# EAGLE design harp to ONIX converter (EAGLE 9.5.1)
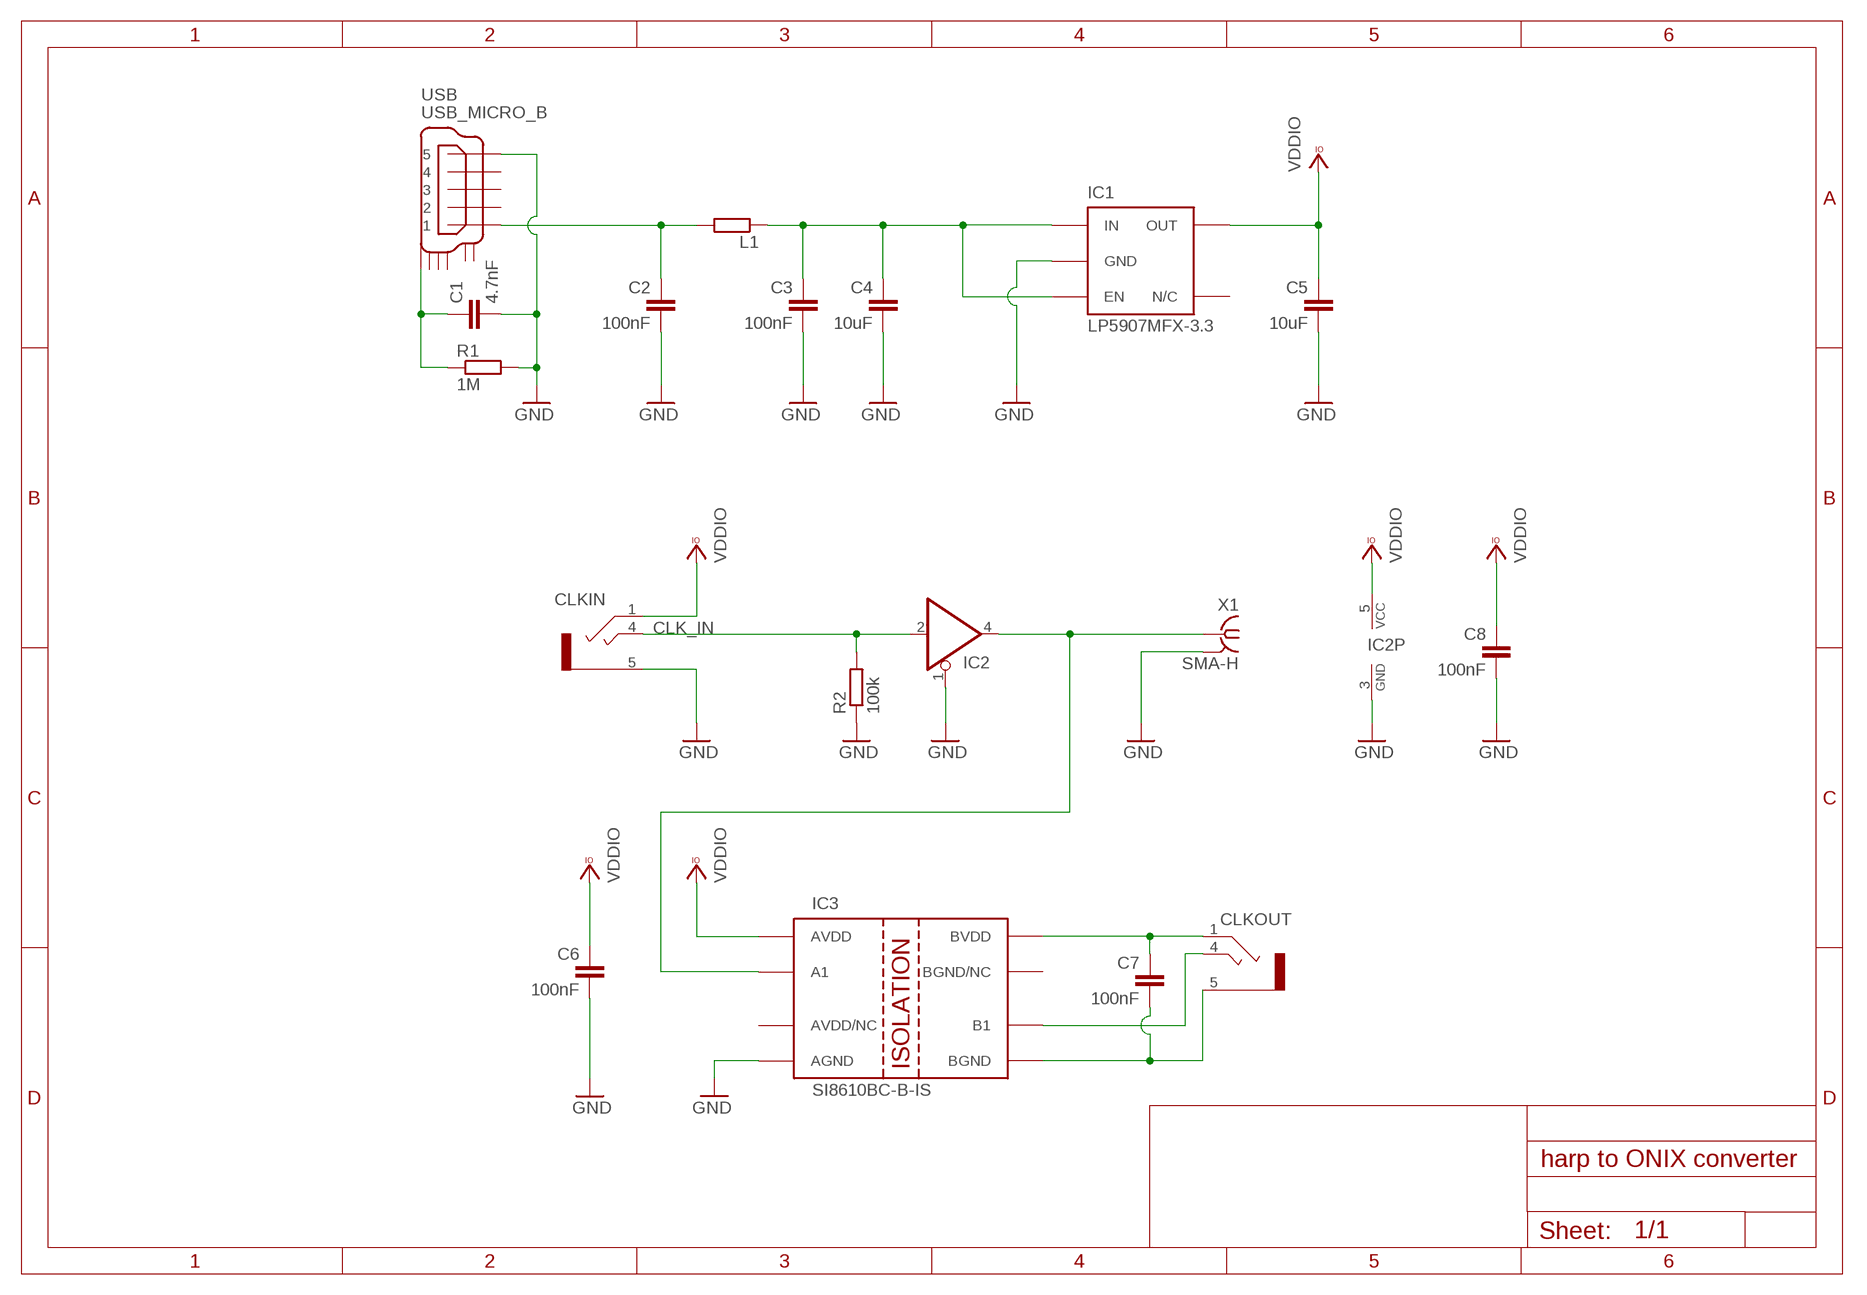
[diagram p0: schematic, sheet 1]

## Parts
C1  4.7nF  C-EUC0402  [C0402]
C2  100nF  C-EUC0402  [C0402]
C3  100nF  C-EUC0402  [C0402]
C4  10uF  C-EUC0603  [C0603]
C5  10uF  C-EUC0603  [C0603]
C6  100nF  C-EUC0402  [C0402]
C7  100nF  C-EUC0402  [C0402]
C8  100nF  C-EUC0402  [C0402]
CLKIN  STEREO_JACK  [35RASMT2BHNTRX]
CLKOUT  CLCK_JACK  STEREO_JACK  [35RASMT2BHNTRX]
IC1  LP5907MFX-3.3  TLV700XX  [TSOT23-5]
IC2  74AHC1G125DBV  [SOT23-5]
IC3  SI8610BC-B-IS  SI8610  [SO-08]
L1  ???  R-EU_R0805  [R0805]
R1  1M  R-EU_R0402  [R0402]
R2  100k  R-EU_R0402  [R0402]
USB  USB_MICRO_B  [ZX62D-B-5P8]
X1  SMA-H  BU-SMA-V  [BU-SMA-V]

## Nets
5V_RAW: C3.1 C4.1 IC1.1(IN) IC1.3(EN) L1.1
CLK_IN: CLKIN.4 IC2.2(I) R2.2
GND: C1.2 C2.2 C3.2 C4.2 C5.2 C6.2 C8.2 CLKIN.5 IC1.2(GND) IC2.1(OE) IC2.3(GND) IC3.4(AGND) R1.2 R2.1 USB.P$5 X1.2 X1.3 X1.4 X1.5
GND_ISO: C7.2 CLKOUT.5 IC3.5(BGND)
N$1: IC2.4(O) IC3.2(A1) X1.1
N$2: CLKOUT.4 IC3.6(B1)
N$5: C7.1 CLKOUT.1 IC3.8(BVDD)
N$39: C2.1 L1.2 USB.P$1
N$59: C1.1 R1.1 USB.SHIELD_4
VCCIO: C5.1 C6.1 C8.1 CLKIN.1 IC1.5(OUT) IC2.5(VCC) IC3.1(AVDD) ; supply symbol labelled VDDIO
Unconnected: IC1.4(N/C) IC3.3(AVDD/NC) IC3.7(BGND/NC) USB.P$2 USB.P$3 USB.P$4 USB.P$6 USB.P$7 USB.SHIELD_1 USB.SHIELD_2 USB.SHIELD_3

## Library data of the parts
C1-C6 C8 = rcl:C-EU: CAPACITOR, European symbol
C7 = rcl:C-EU: CAPACITOR, European symbol; MPN: MC0402B104K160CT; NOTES: -; TYPE: SMD
CLKIN = CNP-connectors:STEREO_JACK
CLKOUT = harp input expander:STEREO_JACK: CONN JACK STEREO 3.5MM SMD R/A; MPN: 35RASMT2BHNTRX; NOTES: -; TYPE: SMD
IC1 = CNP:TLV700XX
IC2 = 74xx-little-de:74*1G125: Single Bus Buffer Gate with 3-State Output
IC3 = harp input expander:SI8610: DGTL ISO 3750VRMS 1CH GP 8SOIC; MPN: SI8610EC-B-IS; NOTES: -; TYPE: SMD
L1 R1 R2 = rcl:R-EU_: RESISTOR, European symbol
USB = CNP-connectors:USB_MICRO_B
X1 = con-coax:BU-SMA-V: FEMALE SMA CONNECTOR Radiall distributor RS 112-3794; OC_FARNELL: unknown; OC_NEWARK: unknown

## Board
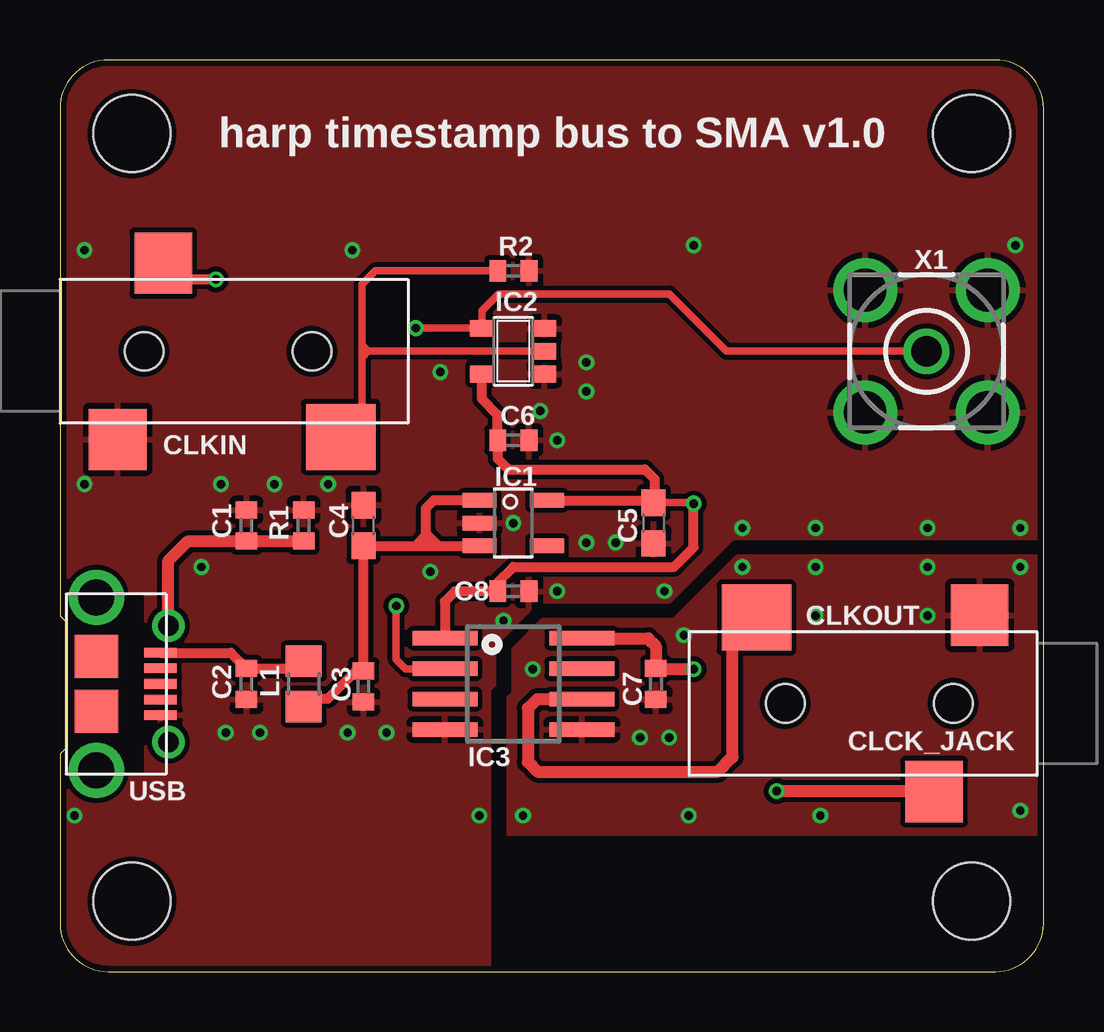
[diagram p1: board, top side]
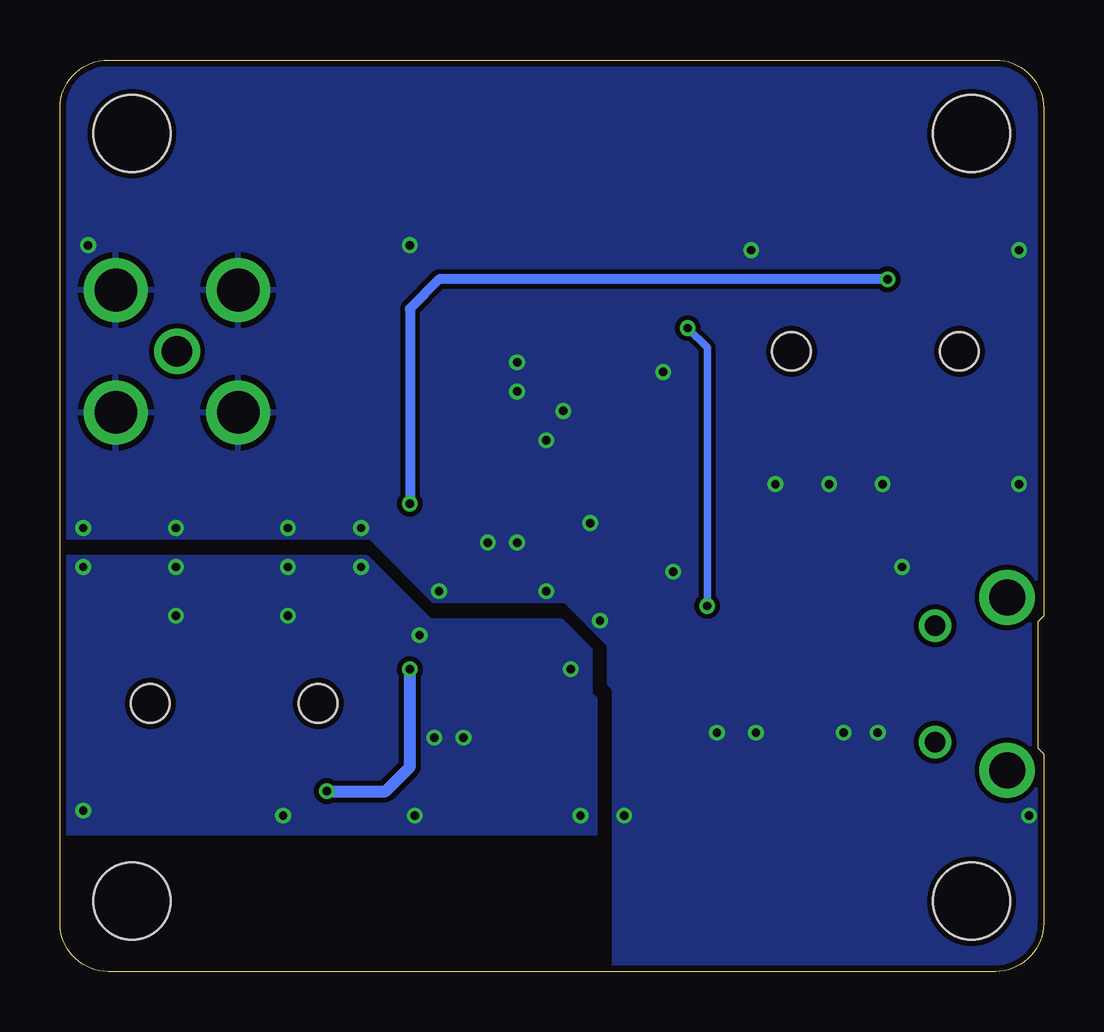
[diagram p2: board, bottom side, seen from below]

Size 41 x 38 mm. Coordinates in mm from the lower left corner, seen from the top.
Outline: 2,0 39,0 arc90 41,2 41,36 arc90 39,38 2,38 arc90 0,36 0,14.83 0.25,14.58 0.25,9.33 0,9.08 0,2 arc90 2,0
Copper layers (1*16): Top 0.035mm / dielectric 1.5mm / Bottom 0.035mm
Design rules "seeed-studio-2-layer": minimum track width 6mil, minimum drill 12mil, track to track 8mil, track to pad 8mil, pad to pad 8mil, via to via 8mil, smd to smd 0mil, copper to edge 10mil, drill to drill 10mil, minimum pad ring 10mil, minimum via ring 6mil, stop-mask expansion 2mil, vias tented up to drill 100mil, thermal gap 10mil
Holes 3.2 mm at 38,2.94 3,2.94 3,34.94 38,34.94

### Footprints (pad centres in the part's own frame; a part is rotated, then mirrored left to right if it is on the bottom)
C0402 = smd 0.7 x 0.9: 1 -0.65,0; 2 0.65,0
C0603 = smd 1.1 x 1: 1 -0.85,0; 2 0.85,0
35RASMT2BHNTRX = smd 2.4 x 2.55: 1 0.8,3.675; 5 -1.1,-3.675 | smd 2.9 x 2.75: 4 8.2,-3.575 | hole 1.6: 0,0; 7,0
TSOT23-5 = smd 0.6 x 1.408: 1 -0.95,-1.404; 2 0,-1.404; 3 0.95,-1.404; 4 0.95,1.404; 5 -0.95,1.404
SOT23-5 = smd 0.69 x 0.99: 1 -0.95,-1.29; 2 0,-1.29; 3 0.95,-1.29; 4 0.95,1.3; 5 -0.95,1.3
SO-08 = smd 0.6 x 2.708: 1 -1.905,-2.854; 2 -0.635,-2.854; 3 0.635,-2.854; 4 1.905,-2.854; 5 1.905,2.854; 6 0.635,2.854; 7 -0.635,2.854; 8 -1.905,2.854
R0805 = smd 1.3 x 1.5: 1 -0.95,0; 2 0.95,0
R0402 = smd 0.7 x 0.9: 1 -0.65,0; 2 0.65,0
ZX62D-B-5P8 = smd 0.4 x 1.35: P$1 -1.3,2.675; P$2 -0.65,2.675; P$3 0,2.675; P$4 0.65,2.675; P$5 1.3,2.675 | smd 1.8 x 1.8: P$6 -1.15,0; P$7 1.15,0 | drill 1.5 pad 2.3: SHIELD_1 -3.6,0; SHIELD_2 3.6,0 | drill 0.85 pad 1.25: SHIELD_3 2.425,3; SHIELD_4 -2.425,3
BU-SMA-V = drill 1.27: 1 0,0 | drill 1.778: 2 -2.55,2.55; 3 2.55,2.55; 4 2.55,-2.55; 5 -2.55,-2.55

### Placement (x,y rotation side)
C1  7.77,18.59 90 top
C2  7.77,11.99 270 top
C3  12.65,11.89 270 top
C4  12.65,18.59 90 top
C5  24.74,18.69 270 top
C6  18.9,22.15 0 top
C7  24.84,11.99 270 top
C8  18.9,15.85 0 top
CLKIN  3.51,25.86 0 top
CLKOUT  37.24,11.18 180 top
IC1  18.9,18.69 270 top
IC2  18.9,25.86 90 top
IC3  18.9,11.99 270 top
L1  10.16,11.99 90 top
R1  10.16,18.59 90 top
R2  18.9,29.21 180 top
USB  1.52,11.99 270 top
X1  36.12,25.86 0 top

### Tracks (layer width: path | path; a pad name or v marks a point on that pad's centre or on a via)
5V_RAW
  Top 0.406: L1.1 10.5,11.38 11.18,11.38 12.33,12.54 C3.1 C4.1 14.83,17.74 | 14.83,17.74 IC1.3 | IC1.1 15.58,19.64 15.24,19.3 15.24,18.29 | 15.24,18.29 15.24,18.15 14.83,17.74 | 15.24,18.29 15.75,17.78
CLK_IN
  Top 0.305: IC2.2 12.85,25.86 | 12.85,25.86 12.6,25.6 | 12.6,25.6 12.6,23.18 CLKIN.4 | R2.2 13.16,29.21 12.6,28.65 12.6,26.11 | 12.6,26.11 12.6,25.6 | 12.85,25.86 12.6,26.11
GND  (via drill 0.35)
  other vias: 40.03,18.49 36.17,18.49 31.5,18.49 28.45,18.49 25.2,15.85 20.73,15.85 18.49,14.63 17.48,6.5 0.61,6.5 13.61,9.96 11.99,9.96 8.33,9.96 6.91,9.96 8.94,20.32 6.71,20.32 11.18,20.32 18.9,18.69 23.16,17.88 21.95,17.88 20.02,23.37 20.73,22.15 21.95,25.4 21.95,24.18 15.85,24.99 39.83,30.28 1.02,30.07 12.19,30.07 26.42,30.28 1.02,20.32 5.89,16.87 15.44,16.66
  pour Top: 17.88,-0.75 17.88,11.79 18.08,11.99 18.08,13.61 19.91,15.44 25.4,15.44 28.04,18.08 43.89,18.08 43.89,40.95 -0.61,40.95 -0.61,-0.75
  pour Bottom: 17.88,-0.75 17.88,11.79 18.08,11.99 18.08,13.61 19.91,15.44 25.4,15.44 28.04,18.08 43.89,18.08 43.89,40.95 -0.61,40.95 -0.61,-0.75
GND_ISO  (via drill 0.35)
  other vias: 36.17,14.83 31.5,14.83 40.03,6.71 25.4,9.75 24.18,9.75 19.71,12.6 26.01,14.02 28.45,16.87 31.5,16.87 36.17,16.87 40.03,16.87 31.7,6.5 26.21,6.5 19.3,6.5
  pour Top: 43.89,17.27 28.24,17.27 25.6,14.63 20.12,14.63 18.9,13.41 18.9,11.58 18.69,11.38 18.69,5.75 43.89,5.75
  pour Bottom: 43.89,17.27 28.24,17.27 25.6,14.63 20.12,14.63 18.9,13.41 18.9,11.58 18.69,11.38 18.69,5.75 43.89,5.75
N$1  (via drill 0.35)
  Top 0.305: X1.1 27.79,25.86 25.4,28.25 18.29,28.25 17.6,27.55 IC2.4 17.58,26.82 v14.83,26.82 | IC3.2 14.4,12.62 14.02,13.01 v14.02,15.24
  Bottom 0.305: v14.02,15.24 14.02,26.01 v14.83,26.82
N$2
  Top 0.508: IC3.6 19.89,11.35 19.51,10.97 19.51,8.74 19.91,8.33 27.43,8.33 28.04,8.94 28.04,13.76 CLKOUT.4
N$5  (via drill 0.35)
  Top 0.508: IC3.8 24.51,13.89 24.84,13.56 C7.1 24.88,12.6 v26.42,12.6 | CLKOUT.1 36.42,7.52 v29.87,7.52
  Bottom 0.508: v29.87,7.52 27.43,7.52 26.42,8.53 v26.42,12.6
N$39
  Top 0.406: USB.P$1 7.12,13.29 C2.1 9.86,12.64 L1.2
N$59
  Top 0.508: USB.SHIELD_4 4.52,17.12 5.34,17.94 C1.1 R1.1
VCCIO  (via drill 0.35)
  Top 0.305: C5.1 26.38,19.54 v26.42,19.51 | 24.79,19.8 24.64,19.64
  Top 0.406: IC1.5 24.64,19.64 C5.1 24.94,19.34 | v26.42,19.51 26.42,17.68 25.6,16.87 18.9,16.87 18.25,16.22 C8.1 16.46,15.85 16.04,15.43 IC3.1 | 24.79,19.8 24.79,20.52 24.38,20.93 18.69,20.93 18.25,21.38 C6.1 18.25,23.2 17.6,23.86 IC2.5 | CLKIN.1 4.98,28.85 v6.5,28.85
  Bottom 0.406: v6.5,28.85 25.2,28.85 26.42,27.64 v26.42,19.51

### Text on the board
tPlace: harp timestamp bus to SMA v1.0